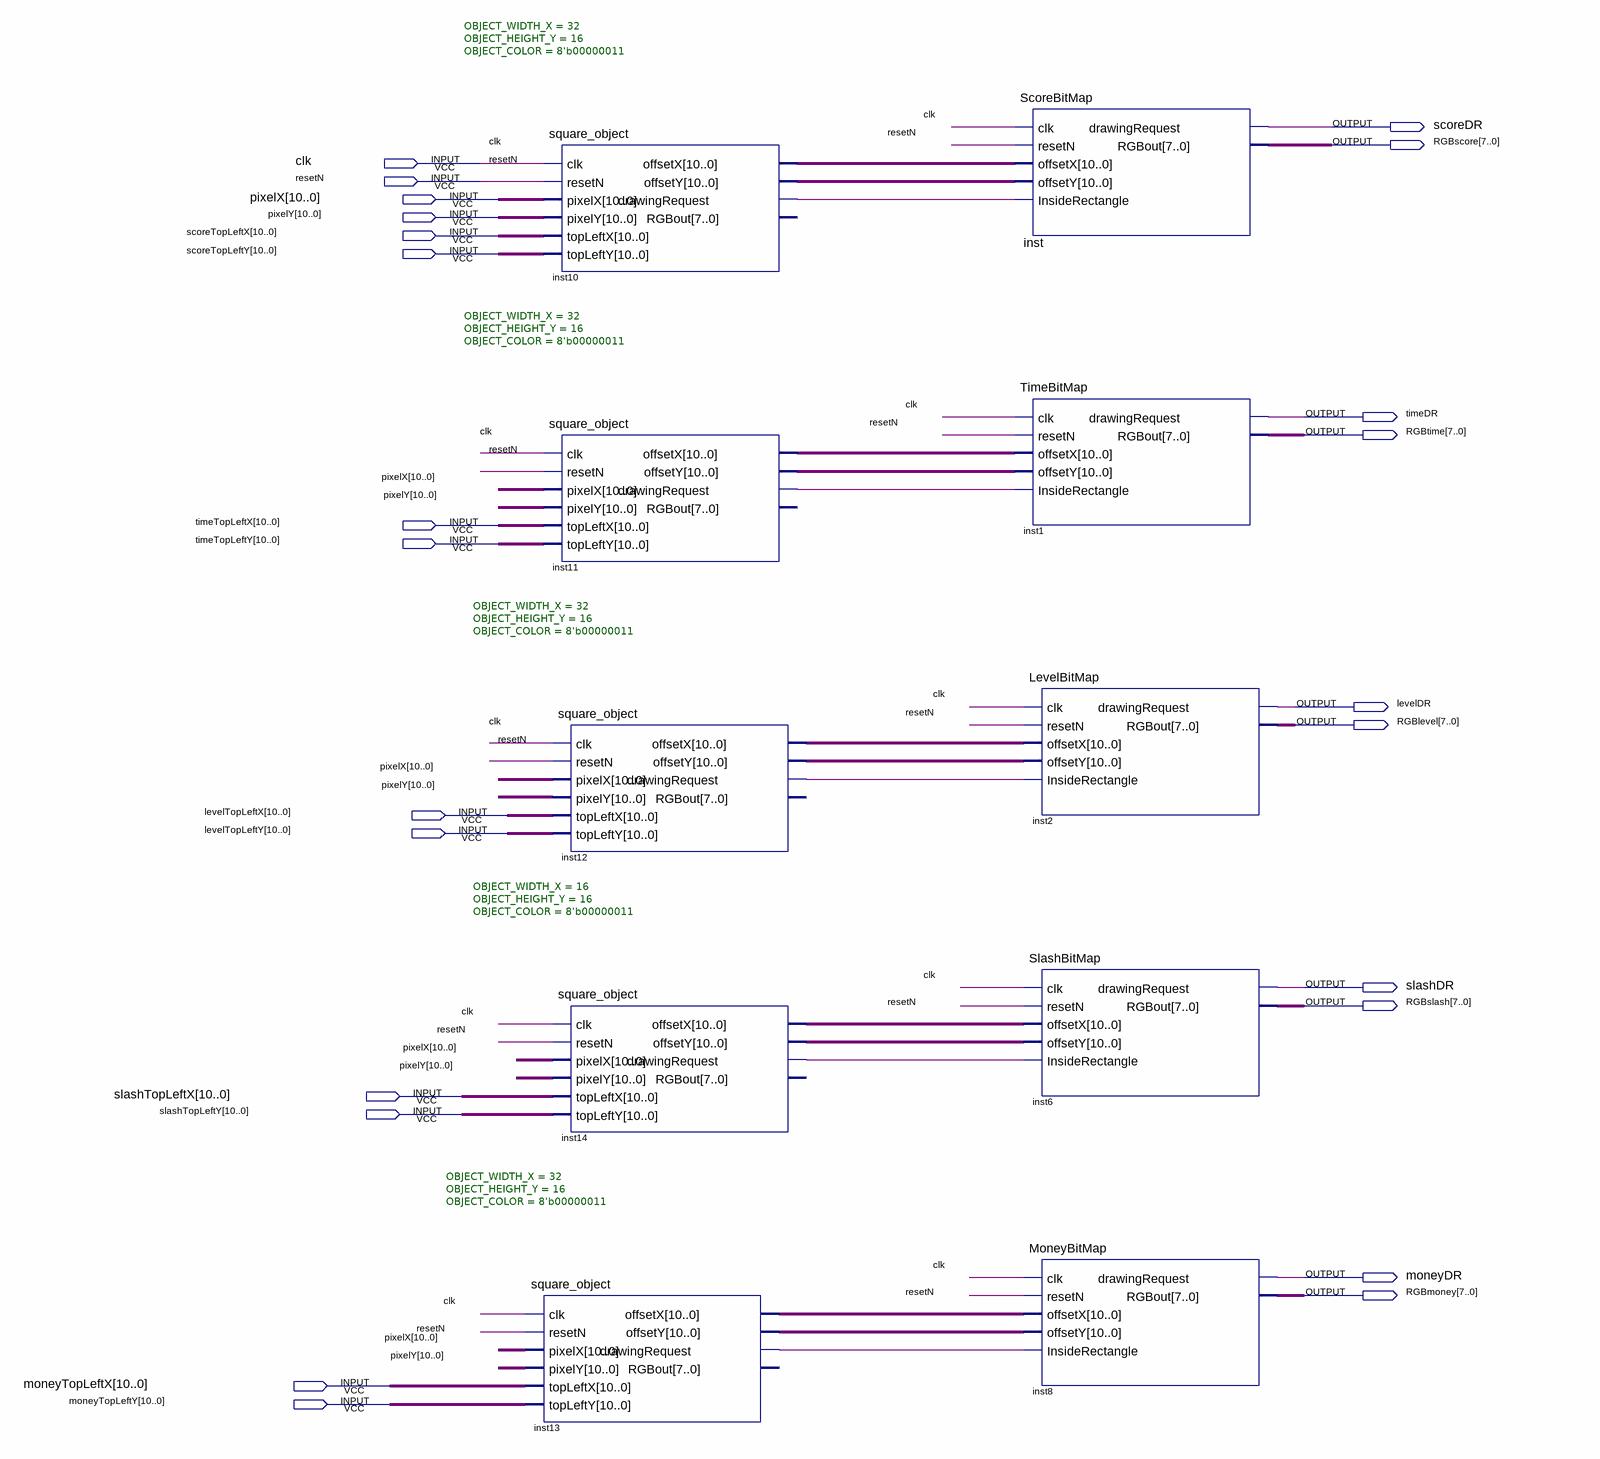
[diagram p0: schematic sheet]
// Quartus schematic Display_Block.bdf as structural Verilog: 10 symbols, 24 pins
module Display_Block (
  input  clk,
  input  resetN,
  input  [10:0] pixelX,
  input  [10:0] pixelY,
  input  [10:0] scoreTopLeftX,
  input  [10:0] scoreTopLeftY,
  input  [10:0] timeTopLeftX,
  input  [10:0] timeTopLeftY,
  input  [10:0] levelTopLeftX,
  input  [10:0] levelTopLeftY,
  input  [10:0] slashTopLeftX,
  input  [10:0] slashTopLeftY,
  input  [10:0] moneyTopLeftX,
  input  [10:0] moneyTopLeftY,
  output scoreDR,
  output [7:0] RGBscore,
  output timeDR,
  output [7:0] RGBtime,
  output levelDR,
  output [7:0] RGBlevel,
  output slashDR,
  output [7:0] RGBslash,
  output moneyDR,
  output [7:0] RGBmoney
);

  wire inst10_drawingrequest, inst11_drawingrequest, inst12_drawingrequest, inst13_drawingrequest,
       inst14_drawingrequest;
  wire [10:0] inst10_offsetx, inst10_offsety, inst11_offsetx, inst11_offsety, inst12_offsetx, inst12_offsety,
       inst13_offsetx, inst13_offsety, inst14_offsetx, inst14_offsety;

  square_object #(.OBJECT_WIDTH_X(32), .OBJECT_HEIGHT_Y(16), .OBJECT_COLOR(8'b00000011)) inst10 (
    .clk(clk), .resetN(resetN), .pixelX(pixelX), .pixelY(pixelY), .topLeftX(scoreTopLeftX),
    .topLeftY(scoreTopLeftY), .offsetX(inst10_offsetx), .offsetY(inst10_offsety),
    .drawingRequest(inst10_drawingrequest));  // open: RGBout
  square_object #(.OBJECT_WIDTH_X(32), .OBJECT_HEIGHT_Y(16), .OBJECT_COLOR(8'b00000011)) inst11 (
    .clk(clk), .resetN(resetN), .pixelX(pixelX), .pixelY(pixelY), .topLeftX(timeTopLeftX),
    .topLeftY(timeTopLeftY), .offsetX(inst11_offsetx), .offsetY(inst11_offsety),
    .drawingRequest(inst11_drawingrequest));  // open: RGBout
  square_object #(.OBJECT_WIDTH_X(32), .OBJECT_HEIGHT_Y(16), .OBJECT_COLOR(8'b00000011)) inst12 (
    .clk(clk), .resetN(resetN), .pixelX(pixelX), .pixelY(pixelY), .topLeftX(levelTopLeftX),
    .topLeftY(levelTopLeftY), .offsetX(inst12_offsetx), .offsetY(inst12_offsety),
    .drawingRequest(inst12_drawingrequest));  // open: RGBout
  square_object #(.OBJECT_WIDTH_X(16), .OBJECT_HEIGHT_Y(16), .OBJECT_COLOR(8'b00000011)) inst14 (
    .clk(clk), .resetN(resetN), .pixelX(pixelX), .pixelY(pixelY), .topLeftX(slashTopLeftX),
    .topLeftY(slashTopLeftY), .offsetX(inst14_offsetx), .offsetY(inst14_offsety),
    .drawingRequest(inst14_drawingrequest));  // open: RGBout
  square_object #(.OBJECT_WIDTH_X(32), .OBJECT_HEIGHT_Y(16), .OBJECT_COLOR(8'b00000011)) inst13 (
    .clk(clk), .resetN(resetN), .pixelX(pixelX), .pixelY(pixelY), .topLeftX(moneyTopLeftX),
    .topLeftY(moneyTopLeftY), .offsetX(inst13_offsetx), .offsetY(inst13_offsety),
    .drawingRequest(inst13_drawingrequest));  // open: RGBout
  ScoreBitMap inst (
    .clk(clk), .resetN(resetN), .offsetX(inst10_offsetx), .offsetY(inst10_offsety),
    .InsideRectangle(inst10_drawingrequest), .drawingRequest(scoreDR), .RGBout(RGBscore));
  TimeBitMap inst1 (
    .clk(clk), .resetN(resetN), .offsetX(inst11_offsetx), .offsetY(inst11_offsety),
    .InsideRectangle(inst11_drawingrequest), .drawingRequest(timeDR), .RGBout(RGBtime));
  LevelBitMap inst2 (
    .clk(clk), .resetN(resetN), .offsetX(inst12_offsetx), .offsetY(inst12_offsety),
    .InsideRectangle(inst12_drawingrequest), .drawingRequest(levelDR), .RGBout(RGBlevel));
  SlashBitMap inst6 (
    .clk(clk), .resetN(resetN), .offsetX(inst14_offsetx), .offsetY(inst14_offsety),
    .InsideRectangle(inst14_drawingrequest), .drawingRequest(slashDR), .RGBout(RGBslash));
  MoneyBitMap inst8 (
    .clk(clk), .resetN(resetN), .offsetX(inst13_offsetx), .offsetY(inst13_offsety),
    .InsideRectangle(inst13_drawingrequest), .drawingRequest(moneyDR), .RGBout(RGBmoney));
endmodule
